# EAGLE design PowerDeliveryCurrent (EAGLE 7.6.0)
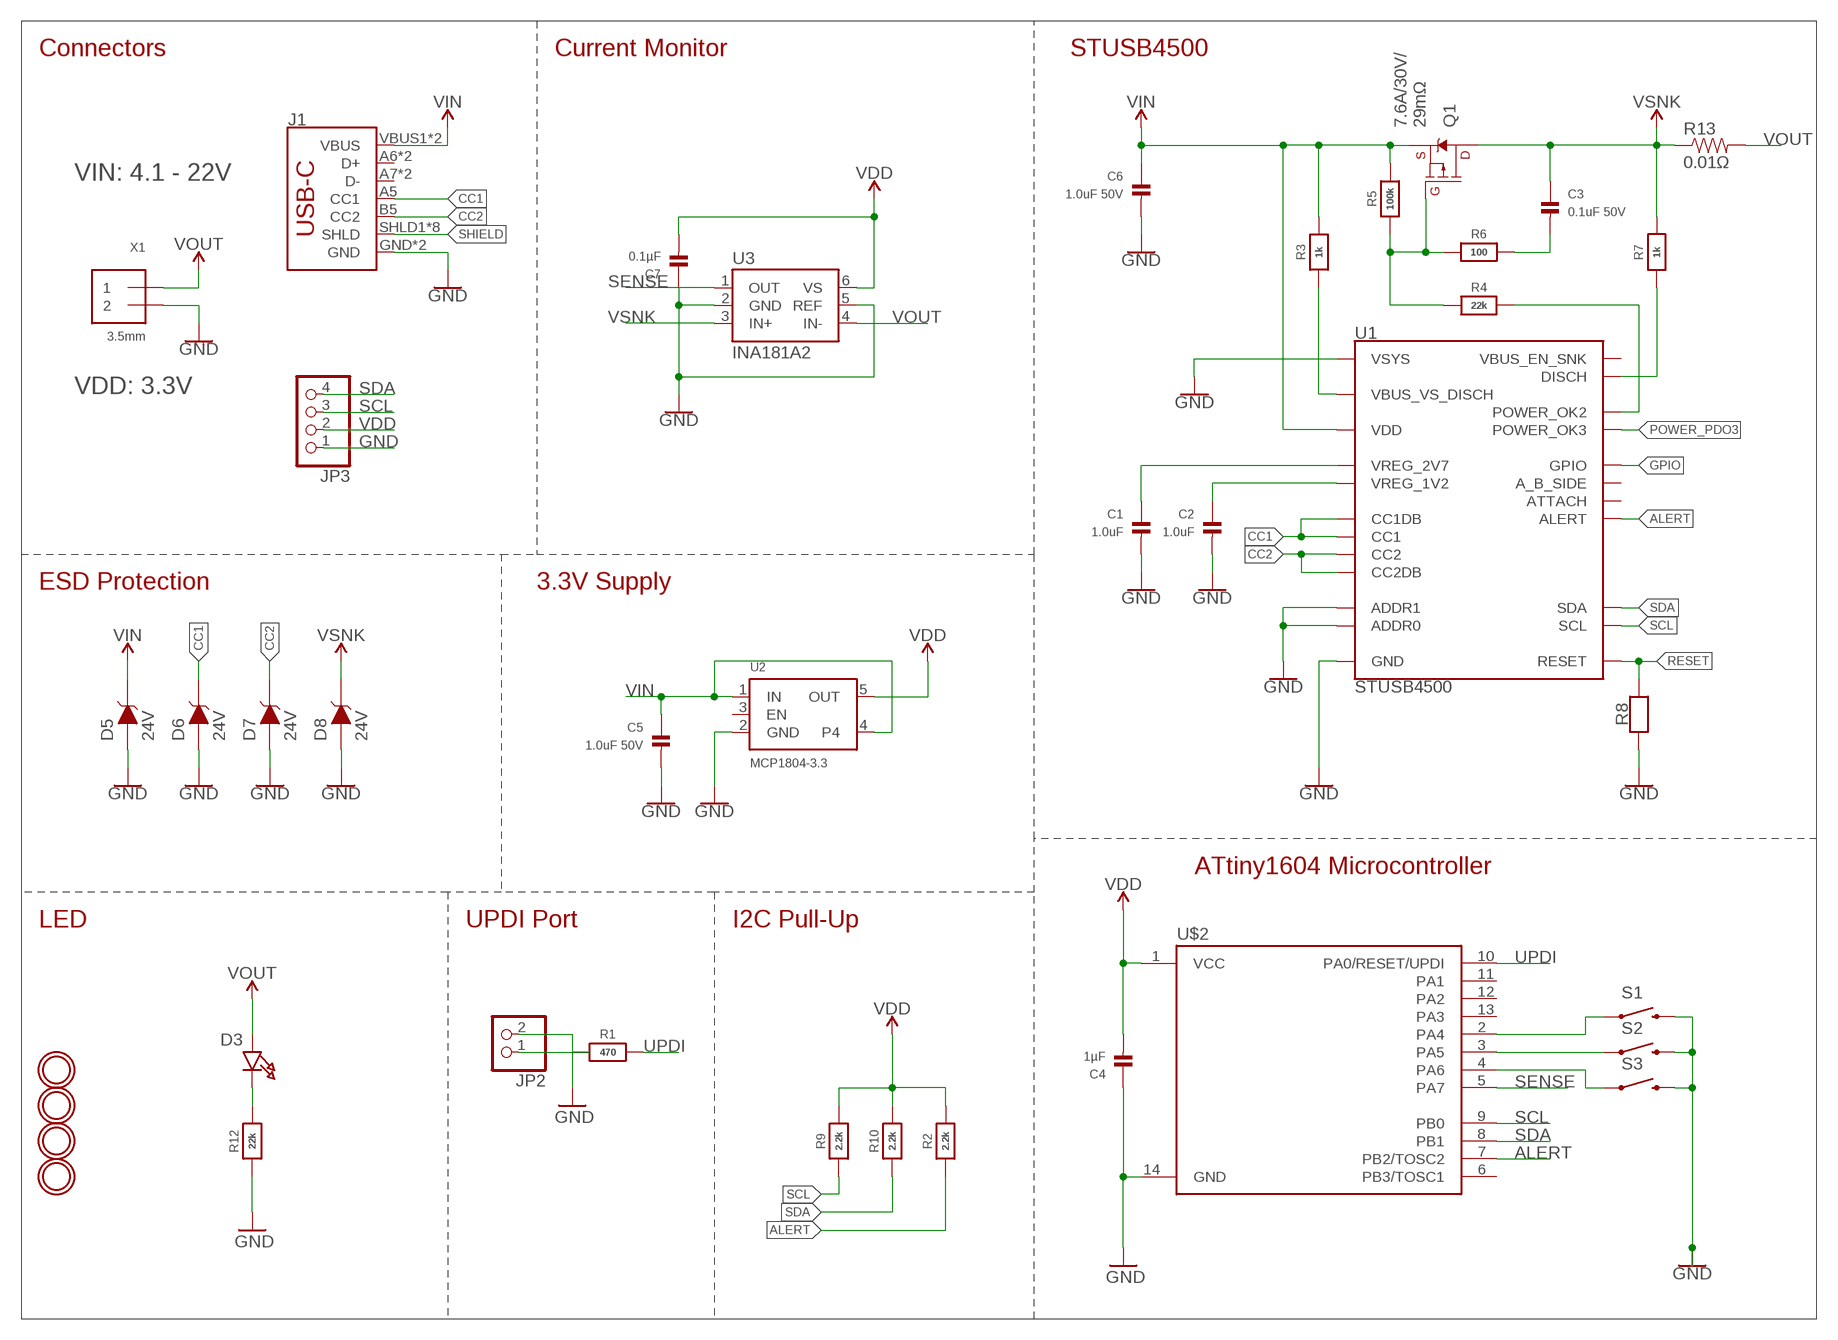
[diagram p0: schematic, sheet 1]

## Parts
C1  1.0uF  CAP_CERAMIC_0805MP  [_0805MP]
C2  1.0uF  CAP_CERAMIC_0805MP  [_0805MP]
C3  0.1uF 50V  CAP_CERAMIC_0805MP  [_0805MP]
C4  1µF  CAP_CERAMIC_0805MP  [_0805MP]
C5  1.0uF 50V  CAP_CERAMIC_0805MP  [_0805MP]
C6  1.0uF 50V  CAP_CERAMIC_0805MP  [_0805MP]
C7  0.1µF  CAP_CERAMIC_0805MP  [_0805MP]
D3  GREEN  LED0805_NOOUTLINE  [CHIPLED_0805_NOOUTLINE]
D5  24V  DIODE_TVS  [0603]
D6  24V  DIODE_TVS  [0603]
D7  24V  DIODE_TVS  [0603]
D8  24V  DIODE_TVS  [0603]
J1  USB_C2-LAYER  [USB-C-16P]
JP2  HEADER-1X2ROUND  [1X02_ROUND]
JP3  HEADER-1X4ROUND  [1X04_ROUND]
Q1  9A/30V/15mΩ  MOSFET_PCH-STL9P3LLH6  [8-POWERVDFN-3X3]
R1  470  RESISTOR_0805MP  [_0805MP]
R2  2.2k  RESISTOR_0805MP  [_0805MP]
R3  1k  RESISTOR_0805MP  [_0805MP]
R4  22k  RESISTOR_0805MP  [_0805MP]
R5  100k  RESISTOR_0805MP  [_0805MP]
R6  100  RESISTOR_0805MP  [_0805MP]
R7  1k  RESISTOR_0805MP  [_0805MP]
R8  100k  RESISTOR_0805MP  [_0805MP]
R9  2.2k  RESISTOR_0805MP  [_0805MP]
R10  2.2k  RESISTOR_0805MP  [_0805MP]
R12  22k  RESISTOR_0805MP  [_0805MP]
R13  0.01Ω  RESISTOR1206  [1206]
S1  SWITCH-MOMENTARY-2SMD-4.6X2.8MM  [TACTILE_SWITCH_SMD_4.6X2.8MM]
S2  SWITCH-MOMENTARY-2SMD-4.6X2.8MM  [TACTILE_SWITCH_SMD_4.6X2.8MM]
S3  SWITCH-MOMENTARY-2SMD-4.6X2.8MM  [TACTILE_SWITCH_SMD_4.6X2.8MM]
U1  STUSB4500  [QFN-24]
U2  MCP1804-3.3  VREG_SOT23-5  [SOT23-5]
U3  INA181A2  MCP4725SOT-23  [SOT23-6]
U$1  MOUNTINGHOLE2.5  [MOUNTINGHOLE_2.5_PLATED]
U$2  ATTINY414  [SO14]
U$3  MOUNTINGHOLE2.5  [MOUNTINGHOLE_2.5_PLATED]
U$4  MOUNTINGHOLE2.5  [MOUNTINGHOLE_2.5_PLATED]
U$6  MOUNTINGHOLE2.5  [MOUNTINGHOLE_2.5_PLATED]
X1  3.5mm  TERMBLOCK_1X2  [TERMBLOCK_1X2-3.5MM]

## Nets
1.2V: C2.1 U1.P$21(VREG_1V2)
2.7V: C1.1 U1.P$23(VREG_2V7)
ALERT: R2.1 U1.P$19(ALERT) U$2.7(PB2/TOSC2)
CC1: D6.2(C) J1.A5(CC1) U1.P$1(CC1DB) U1.P$2(CC1)
CC2: D7.2(C) J1.B5(CC2) U1.P$4(CC2) U1.P$5(CC2DB)
DISCH: R7.2 U1.P$9(DISCH)
EN_SNK: R4.1 U1.P$20(POWER_OK2)
GND: C1.2 C2.2 C4.1 C5.2 C6.2 C7.1 D5.1(A) D6.1(A) D7.1(A) D8.1(A) J1.GND J1.GND2(GND) JP2.2 JP3.1 R8.1 R12.1 S1.3 S1.4 S2.3 S2.4 S3.3 S3.4 U1.P$10(GND) U1.P$12(ADDR0) U1.P$13(ADDR1) U1.P$22(VSYS) U1.P$25(GND) U2.2(GND) U3.2(GND) U3.5(REF) U$2.14(GND) X1.2
GPIO: U1.P$15(GPIO)
N$1: S3.1 S3.2 U$2.4(PA6)
N$2: D3.C R12.2
N$3: JP2.1 R1.1
N$4: S2.1 S2.2 U$2.3(PA5)
N$5: S1.1 S1.2 U$2.2(PA4)
N$8: Q1.4(G) R4.2 R5.1 R6.1
N$10: C3.2 R6.2
POWER_PDO3: U1.P$14(POWER_OK3)
RESET: R8.2 U1.P$6(RESET)
SCL: JP3.3 R9.1 U1.P$7(SCL) U$2.9(PB0)
SDA: JP3.4 R10.1 U1.P$8(SDA) U$2.8(PB1)
SENSE: U3.1(OUT) U$2.5(PA7)
SHIELD: J1.SHLD1(SHLD) J1.SHLD2(SHLD) J1.SHLD3(SHLD) J1.SHLD4(SHLD) J1.SHLD5(SHLD) J1.SHLD6(SHLD) J1.SHLD7(SHLD) J1.SHLD8(SHLD)
UPDI: R1.2 U$2.10(PA0/RESET/UPDI)
VBUS_VS_DISCH: R3.1 U1.P$18(VBUS_VS_DISCH)
VDD: C4.2 C7.2 JP3.2 R2.2 R9.2 R10.2 U2.5(OUT) U3.6(VS) U$2.1(VCC)
VIN: C5.1 C6.1 D5.2(C) J1.VBUS1(VBUS) J1.VBUS2(VBUS) Q1.1(S) Q1.2(S) Q1.3(S) R3.2 R5.2 U1.P$24(VDD) U2.1(IN) U2.4
VOUT: D3.A R13.2 U3.4(IN-) X1.1
VSNK: C3.1 D8.2(C) Q1.5@1(D) Q1.5@2(D) Q1.5@3(D) R7.1 R13.1 U3.3(IN+)
Unconnected: J1.A6(D+) J1.A7(D-) J1.B6(D+) J1.B7(D-) U1.P$11(ATTACH) U1.P$16(VBUS_EN_SNK) U1.P$17(A_B_SIDE) U2.3(EN) U$2.6(PB3/TOSC1) U$2.11(PA1) U$2.12(PA2) U$2.13(PA3)

## Notes on the sheet
- Connectors | Current Monitor | STUSB4500
- 7.6A/30V/
  29mΩ
- VIN: 4.1 - 22V
- VDD: 3.3V
- ESD Protection | 3.3V Supply
- ATtiny1604 Microcontroller
- LED | UPDI Port | I2C Pull-Up

## Library data of the parts
C1-C7 = microbuilder:CAP_CERAMIC: Ceramic Capacitors 0402 - 0402 Surface Mount Capacitors 16pF 50V 5% [Digikey: 445-4899-2-ND] 18pF 50V 5% [Digikey: 490-1281-2-ND] 22pF 50V 5% [Digikey: 490-1283-2-ND] 68pF 50V 5% [Digikey: 490-1289-2-ND] 0.1uF 10V 10% [Digikey: 490-1318-2-ND] 1.0uF 6.3V 10% [Digikey: 490-1320-2-ND] 0603 - 0603 Surface Mount Capacitors 16 pF 50V 5% [Digikey: 445-5051-2-ND] 22 pF 50V [Digikey: PCC220ACVTR-ND] 33 pF 50V 5% [Digikey: 490-1415-1-ND] 56pF 50V 5% [Digikey: 490-1421-1-ND] 220pF 50V 5% [Digikey: 445-1285-1-ND] 680 pF 50V 2200 pF 50V 5% C0G [Digikey: 445-1297-1-ND] 5600 pF 100V 5% X7R [Digikey: 478-3711-1-ND] 0.1 µF 25V 10% [Digikey: PCC2277TR-ND] 0.22 µF 16V 10% X7R [Digikey: 445-1318-1-ND] 1.0 µF 25V 10% [Digikey: 445-5146-2-ND] 0603 - RF Specific 3pF 250V +/-0.1pF RF [Digikey: 712-1347-1-ND] 18 pF 250V 5% [Digikey: 478-3505-1-ND or 712-1322-1-ND] 56 pF 250V 5% C0G RF [Digikey: 490-4867-1-ND] 68 pF 250V RF [Digikey: 490-4868-1-ND] 0805 - 0805 Surface Mount Capacitors 220 pF 250V 2% RF Ceramic Capacitor [Digikey: 712-1398-1-ND] 1000 pF 50V 2% NP0 Ceramic Capacitor [Digikey: 478-3760-1-ND] 0.1 µF 25V 10% Ceramic Capacitor [Digikey: PCC1828TR-ND] 1.0 µF 16V 10% Ceramic Capacitor[Digikey: 490-1691-2-ND] 10.0 µF 10V 10% Ceramic Capacitor[Digikey: 709-1228-1-ND] 10.0 uF 16V 10% Ceramic Capacitor [Digikey: 478-5165-2-ND] 47 uF 6.3V 20% Ceramic Capacitor [Digikey: 587-1779-1-ND or 399-5506-1-ND] 1206 - 1206 Surface Mount Capacitors 47uF 10V 20% Ceramic Capacitor [Digikey: 490-5528-1-ND or 399-5508-1-ND or 445-6010-1-ND] 100uF 6.3V -20%, +80% Y5V Ceramic Capacitor (Digikey: 490-4512-1-ND, Mouser: 81-GRM31CF50J107ZE1L)
D3 = microbuilder:LED: LED 0603 - 0603 Surface Mount Package 2mA: Green LED - Low Power (3.9mcd, 2ma, 1.7Vf) - Digikey: 475-2709-2-ND Orange LED - Low Power (9.8mcd, 2ma, 1.8Vf) - Digikey: 475-1194-2-ND Red LED - Low Power (5mcd, 2ma, 1.8Vf) - Digikey: 475-1195-2-ND Yellow LED - Low Power (7mcd, 2ma, 1.8Vf) - Digikey: 475-1196-2-ND 5mA: Blue LED - Low Power (17mcd, 5ma, 2.9Vf) - Digikey: LNJ937W8CRACT-ND 0805 - 0805 Surface Mount Package 2mA: Red LED (8.8mcd, 2mA, 1.8Vf, Clear) - Low Power [Digikey: 475-2510-1-ND] Green LED (5mcd, 2mA, 1.8Vf, Clear) - Low Power [Digikey: 475-2730-1-ND] Yellow LED (11.3mcd, 2mA, 1.8Vf, Clear) - Low Power [Digikey: 475-2555-1-ND] 20mA: Red LED (104mcd, 20mA, Diffused) - LS R976 [Digikey: 475-1278-6-ND] Red LED (12mcd, 20mA, 2.0Vf, Clear) - APT2012EC [Digikey: 754-1128-1-ND] Green LED (15mcd, 20mA, 2.2Vf, Clear) - APT2012GC [Digikey: 754-1131-1-ND] Orange LED (160mcd, 20mA, 2.1Vf, Clear) - APT2012SECK [Digikey: 754-1130-1-ND] 1206 - 1206 Surface Mount Package Green LED (26mcd, 20mA, Diffused) - LG N971 [Digikey: 475-1407-6-ND] Red LED (15mcd, 20mA, Diffused) - LH N974 [Digikey: 475-1416-6-ND]
D5-D8 = technoblogy:DIODE_TVS; PROD_ID: DIO-14502
J1 = SparkFun-Connectors:USB_C: USB Type C 16Pin Connector Super Speed pins not available on the 16-pin purely SMD connector so this part is best for USB 2.0 implementations. D1 and D2 are tied together enabling D+/- no matter which way the cable is plugged into the connector. The two channel configuration pins (CC1/2) are exposed. These are normally connected to ground via 5.1k resistors but can be reconfigured for high current/high power applications.; PROD_ID: CONN-14122
JP2 = microbuilder:HEADER-1X2: PIN HEADER
JP3 = microbuilder:HEADER-1X4: PIN HEADER
Q1 = SparkFun-DiscreteSemi:MOSFET_PCH: P-channel MOSFETs Voltage controlled devices that allow control of high current outputs. SparkFun Products: SparkFun ESP32 Thing <https://www.sparkfun.com/products/13907> SparkFun ESP8266 Thing <https://www.sparkfun.com/products/13231> SparkFun Pi Servo HAT V2 <https://www.sparkfun.com/products/15316> DMG2305UX-7 (20V/4.2A/SOT23-3); PROD_ID: TRANS-14715
R1-R10 R12 = microbuilder:RESISTOR: Resistors For new designs, use the packages preceded by an '_' character since they are more reliable: The following footprints should be used on most boards: _0402 - Standard footprint for regular board layouts _0603 - Standard footprint for regular board layouts _0805 - Standard footprint for regular board layouts _1206 - Standard footprint for regular board layouts For extremely tight-pitch boards where space is at a premium, the following 'micro-pitch' footprints can be used (smaller pads, no silkscreen outline, etc.): _0402MP - Micro-pitch footprint for very dense/compact boards _0603MP - Micro-pitch footprint for very dense/compact boards _0805MP - Micro-pitch footprint for very dense/compact boards _1206MP - Micro-pitch footprint for very dense/compact boards
R13 = SparkFun-Resistors:RESISTOR: Resistor Basic schematic elements and footprints for 0603, 1206, and PTH resistors.
S1-S3 = SparkFun-Electromechanical:SWITCH-MOMENTARY-2: Various NO switches- pushbuttons, reed, etc; PROD_ID: SWCH-13065
U1 = SparkFun-IC-Power:STUSB4500; PROD_ID: IC-14684
U2 = microbuilder:VREG_SOT23-5: SOT23-5 Fixed Voltage Regulators Part Current Out V Out V In V Dropout θJA (°C/W) TJ (°C) Digikey Part No. ADP121 150mA 3.3V 3.4-5.5V 0.09V @ 150mA -- -- ADP121-AUJZ33R7CT-ND ADP121 150mA 3.0V 3.1-5.5V 0.09V @ 150mA -- -- ADP121-AUJZ30R7CT-ND ADP122 300mA 3.3V 3.4-5.5V 0.085V @ 300mA -- -- ADP122AUJZ-3.3-R7CT-ND ADP1712 300mA 3.3V 3.5-5.5V 0.17V @ 300mA -- -- ADP1712AUJZ-3.3-R7TR-ND AP7311 (Low Cost) 150mA 3.3V 3.5-6V 0.15V @ 150mA -- -- AP7311-33WG-7DICT-ND LD39015M18R 150mA 1.8V 1.9V-5.5V 0.08V @ 100mA -- -- 497-6977-1-ND LP2985A-33DBVR 150mA 3.3V 3.3-16V 0.28V @ 150mA 206 150 296-18479-1-ND MCP1824T-3302E/OT 300mA 3.3V 3.5V-6V 0.2V @ 300mA -- -- MCP1824T-3302E/OTCT-ND MIC5205-2.5YM5 TR 150mA 2.5V 2.7-16V 0.165V @ 150mA -- -- 576-1257-2-ND MIC5205-3.0YM5 TR 150mA 3.0V 3.2V-16V 0.165V @ 150mA -- -- 576-1258-2-ND MIC5205-3.3YM5 TR 150mA 3.3V 3.5V-16V 0.165V @ 150mA -- -- 576-1259-2-ND TPS780330220 150mA 3.3V+2.2V 3.6-5.5V 250mV Max -- -- 296-23332-1-ND TDA3663/N1,135 100mA 3.3V 3.5-45V 0.18V @ 50mA -- -- 568-5343-1-ND Max operating temp can be calculated using θJA, TJ (max junction temperature), and power in watts. Set the "Maximum Ambient Temperature" until it reaches TJ ("Max Junction Temperature"), which is the absolute limit for safe use of the regulator: Heat Sink Temperature Calculator <http://www.daycounter.com/Calculators/Heat-Sink-Temperature-Calculator.phtml> For example, With 12V source into a 3.3V LP2985 and a 30mA load, we are dissipating (12V-3.3V) * 0.03A = 0.261W. With a θJA of 206 °C/W, a TJ of 150°C, and 261mW we can safely use the chip without a heat sink up to 75°C (=147.1°C Junction Temperature).
U3 = technoblogy:MCP4725: Current Sensor; PROD_ID: IC-08886; VALUE: MCP4725
U$1 U$3 U$4 U$6 = microbuilder:MOUNTINGHOLE: Mounting Hole For #2 screws (0.086"/2.18mm width, 0.094"/2.4mm hole) use 2.5mm; BOM: EXCLUDE
U$2 = technoblogy:ATTINY414: Atmel 14-pin 2/4/8kB flash uC; PROD_ID: IC-11285
X1 = microbuilder:TERMBLOCK_1X2: 3.5mm Terminal block http://www.ladyada.net/library/pcb/eaglelibrary.html

## Net classes
0 default: width 0.152 mm, drill 0.305 mm, clearance 0.152 mm

## Board
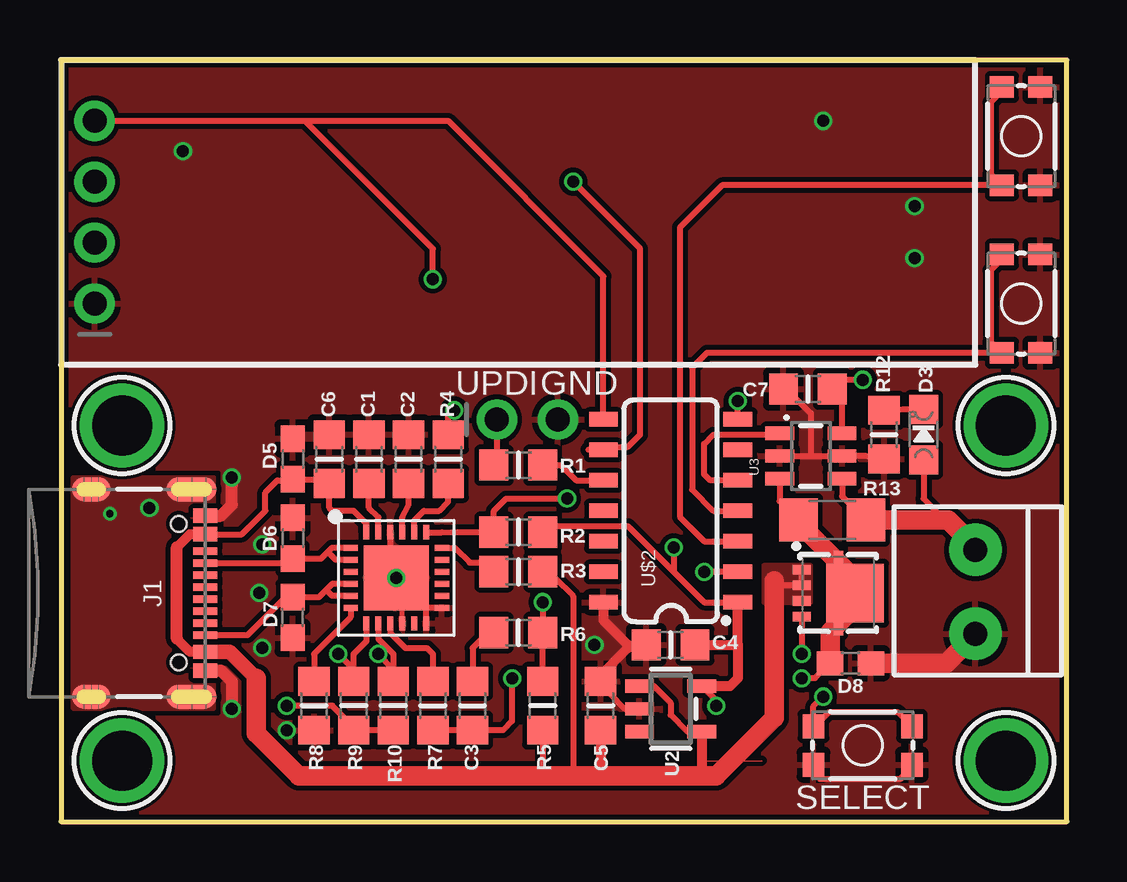
[diagram p1: board, top side]
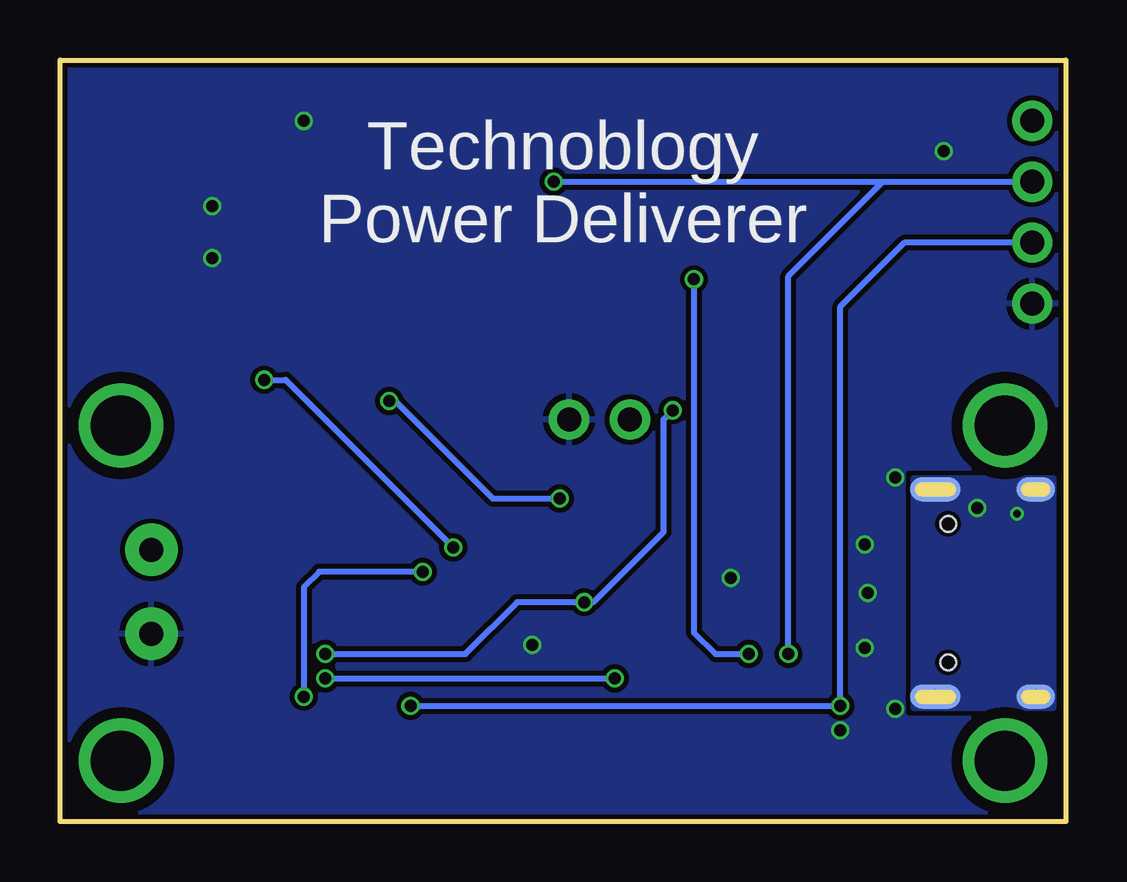
[diagram p2: board, bottom side, seen from below]

Size 41.91 x 31.75 mm. Coordinates in mm from the lower left corner, seen from the top.
Outline: 41.91,0 41.91,31.75 0,31.75 0,0 41.91,0
Copper layers (1*16): Top 0.035mm / dielectric 1.5mm / Bottom 0.035mm
Design rules "SparkFun-2-layer-FAB-LIMIT": minimum track width 4mil, minimum drill 6mil, track to track 4mil, track to pad 4mil, pad to pad 4mil, via to via 4mil, smd to smd 4mil, copper to edge 4mil, drill to drill 4mil, minimum pad ring 5mil, minimum via ring 5mil, stop-mask expansion 4mil, vias tented up to drill 25mil, thermal gap 10mil
tRestrict: 4 lines

### Footprints (pad centres in the part's own frame; a part is rotated, then mirrored left to right if it is on the bottom)
_0805MP = smd 1.2 x 1.3: 1 -1.016,0; 2 1.016,0
CHIPLED_0805_NOOUTLINE = smd 1.2 x 1.2: A 0,-1.05; C 0,1.05
0603 = smd 1.1 x 1: 1 -0.85,0; 2 0.85,0
USB-C-16P = smd 0.3 x 1: A5 -1.25,-0.34; A6 -0.25,-0.34; A7 0.25,-0.34; A8 1.25,-0.34; B5 1.75,-0.34; B6 0.75,-0.34; B7 -0.75,-0.34; B8 -1.75,-0.34 | smd 0.6 x 1: GND -3.225,-0.34; GND2 3.225,-0.34; VBUS1 -2.45,-0.34; VBUS2 2.45,-0.34 | smd 1 x 2.1: SHLD1 -4.32,-0.915; SHLD2 4.32,-0.915 | smd 1 x 2.1 bottom: SHLD3 -4.32,-0.915; SHLD4 4.32,-0.915 | smd 1 x 1.6: SHLD5 -4.32,-5.095; SHLD8 4.32,-5.095 | smd 1 x 1.6 bottom: SHLD6 -4.32,-5.095; SHLD7 4.32,-5.095 | hole 0.65: -2.89,-1.445; 2.89,-1.445
1X02_ROUND = drill 1 pad 1.676: 1 -1.27,0; 2 1.27,0
1X04_ROUND = drill 1 pad 1.676: 1 -3.81,0; 2 -1.27,0; 3 1.27,0; 4 3.81,0
8-POWERVDFN-3X3 = smd 0.4 x 0.75: 1 -0.975,-1.525; 2 -0.325,-1.525; 3 0.325,-1.525; 4 0.975,-1.525 | smd 2.45 x 2.4: 5@1 0,0.7 | smd 0.53 x 0.4: 5@2 -1.49,0; 5@3 1.49,0
1206 = smd 1.6 x 1.8: 1 -1.4,0; 2 1.4,0
TACTILE_SWITCH_SMD_4.6X2.8MM = smd 0.9 x 1: 1 -2.05,-0.8; 2 2.05,-0.8; 3 2.05,0.8; 4 -2.05,0.8
QFN-24 = smd 0.6 x 0.25: P$1 -1.9,1.25; P$2 -1.9,0.75; P$3 -1.9,0.25; P$4 -1.9,-0.25; P$5 -1.9,-0.75; P$6 -1.9,-1.25; P$13 1.9,-1.25; P$14 1.9,-0.75; P$15 1.9,-0.25; P$16 1.9,0.25; P$17 1.9,0.75; P$18 1.9,1.25 | smd 0.25 x 0.6: P$7 -1.25,-1.9; P$8 -0.75,-1.9; P$9 -0.25,-1.9; P$10 0.25,-1.9; P$11 0.75,-1.9; P$12 1.25,-1.9; P$19 1.25,1.9; P$20 0.75,1.9; P$21 0.25,1.9; P$22 -0.25,1.9; P$23 -0.75,1.9; P$24 -1.25,1.9 | smd 2.7 x 2.7: P$25 0,0
SOT23-5 = smd 0.55 x 1.2: 1 -0.95,-1.3; 2 0,-1.3; 3 0.95,-1.3; 4 0.95,1.3; 5 -0.95,1.3
SOT23-6 = smd 0.55 x 1.2: 1 0.95,1.3; 2 0,1.3; 3 -0.95,1.3; 4 -0.95,-1.3; 5 0,-1.3; 6 0.95,-1.3
MOUNTINGHOLE_2.5_PLATED = drill 2.5 pad 3.2: P$1 0,0
SO14 = smd 0.6 x 1.2: 1 -3.81,-2.8; 2 -2.54,-2.8; 3 -1.27,-2.8; 4 0,-2.8; 5 1.27,-2.8; 6 2.54,-2.8; 7 3.81,-2.8; 8 3.81,2.8; 9 2.54,2.8; 10 1.27,2.8; 11 0,2.8; 12 -1.27,2.8; 13 -2.54,2.8; 14 -3.81,2.8
TERMBLOCK_1X2-3.5MM = drill 1 pad 2.184: 1 1.8,0; 2 -1.7,0

### Placement (x,y rotation side)
C1  12.83,15.11 90 top
C2  14.48,15.11 90 top
C3  17.14,4.83 90 top
C4  25.4,7.37 0 top
C5  22.48,4.83 90 top
C6  11.18,15.11 90 top
C7  31.11,18.03 0 top
D3  35.94,16.13 0 top
D5  9.65,15.11 270 top
D6  9.65,11.81 270 top
D7  9.65,8.51 90 top
D8  32.89,6.6 180 top
J1  6.35,9.53 270 top
JP2  19.43,16.76 0 top
JP3  1.4,25.4 90 top
Q1  32.38,9.53 270 top
R1  19.05,14.86 0 top
R2  19.05,12.06 0 top
R3  19.05,10.41 0 top
R4  16.13,15.11 90 top
R5  20.07,4.83 270 top
R6  19.05,7.87 180 top
R7  15.49,4.83 90 top
R8  10.54,4.83 90 top
R9  12.19,4.83 270 top
R10  13.84,4.83 270 top
R12  34.29,16.13 90 top
R13  32.13,12.57 0 top
S1  33.4,3.18 180 top
S2  40.01,28.57 270 top
S3  40.01,21.59 270 top
U1  13.97,10.16 0 top
U2  25.4,4.7 270 top
U3  31.24,15.24 90 top
U$1  39.37,2.54 0 top
U$2  25.4,12.95 90 top
U$3  39.37,16.51 0 top
U$4  2.54,2.54 0 top
U$6  2.54,16.51 0 top
X1  38.1,9.53 90 top

### Tracks (layer width: path | path; a pad name or v marks a point on that pad's centre or on a via)
1.2V
  Top 0.254: U1.P$21 14.22,12.7 14.48,13.21 C2.1
2.7V
  Top 0.254: U1.P$23 13.22,12.69 12.83,13.08 C1.1
ALERT  (via drill 0.5)
  Top 0.254: U1.P$19 15.87,12.06 16.51,12.06 R2.1 18.03,12.95 18.54,13.46 v21.08,13.46 | U$2.7 v28.2,17.52 v28.19,17.53
  Bottom 0.254: v28.19,17.53 27.94,17.53 23.88,13.46 v21.08,13.46
CC1
  Top 0.254: J1.A5 9.47,10.78 D6.2 10.83,10.96 11.11,11.24 | U1.P$1 11.28,11.41 11.11,11.24 | U1.P$2 11.44,10.91 11.11,11.24
CC2
  Top 0.254: J1.B5 7.78,7.78 9.27,9.27 9.56,9.27 D7.2 10.76,9.36 11.05,9.65 | U1.P$5 11.29,9.41 11.05,9.65 | U1.P$4 11.31,9.91 11.05,9.65
DISCH
  Top 0.254: U1.P$9 13.72,7.87 14.35,7.24 15.24,7.24 15.49,6.99 R7.2
EN_SNK
  Top 0.254: U1.P$20 14.72,12.56 15.11,12.95 15.75,12.95 16.13,13.33 R4.1
GND  (via drill 0.5)
  Top 0.178: C7.1 30.23,18.03
  Top 0.203: U1.P$10 14.22,9.91 U1.P$25
  Top 0.254: 23.62,7.37 C4.1 23.75,7.37 23.62,7.24 22.86,6.48 | 22.86,5.33 23.5,4.7 U2.2 | 13.72,10.41 U1.P$25 | U1.P$22 13.72,10.41 U1.P$25 | U1.P$12 15.22,8.91 | U1.P$13 15.22,8.91 | 15.22,8.91 U1.P$25 | U3.2 31.24,15.24 | 31.24,15.24 U3.5 33.53,15.24 34.42,14.99 R12.1 | 30.23,18.03 31.24,17.02 31.24,15.24 | S1.3 31.41,1.99 31.62,1.78 34.98,1.78 S1.4
  Top 0.406: U$2.14 22.6,8.39 23.62,7.37 | C5.2 22.48,6.1 23.62,7.24 | C4.1 24.13,7.62
  Top 0.508: 7.11,14.02 v7.11,14.35 7.11,13.21 6.65,12.75 J1.GND | J1.GND2 6.65,6.3 7.11,5.84 v7.11,4.7
  Top 0.813: D8.1 36.88,6.6 X1.2
  other vias: 13.97,10.16 8.38,11.56 5.08,27.94 8.26,9.53 22.23,7.37 8.38,7.24 9.4,3.81 35.56,23.49 35.56,25.65 31.75,29.21
  pour Top (isolate 0.203, rank 2): 0,31.75 41.91,31.75 41.91,0 0,0
  pour Bottom (isolate 0.203, rank 2): 0,31.75 41.91,31.75 41.91,0 0,0
N$1
  Top 0.254: U$2.4 27.18,12.95 26.29,13.84 26.29,18.92 26.91,19.54 S3.2 38.73,20.01 38.73,22.99 39.2,23.46 S3.1
N$2
  Top 0.254: D3.C 35.09,17.18 R12.2
N$3
  Top 0.254: JP2.1 18.16,14.99 R1.1
N$4
  Top 0.254: U$2.3 26.8,11.68 25.78,12.7 25.78,24.77 27.54,26.52 S2.2 38.73,26.99 38.73,29.97 39.2,30.44 S2.1
N$5  (via drill 0.5)
  Top 0.254: U$2.2 v26.8,10.41 | v31.75,5.21 31.35,4.81 S1.2 31.41,3.97 32,4.57 34.85,4.57 S1.1
  Bottom 0.254: v26.8,10.41 31.11,10.41 31.75,9.78 v31.75,5.21
N$8  (via drill 0.5)
  Top 0.254: R5.1 R6.1 | 20.28,7.75 20.28,7.62 | 20.28,7.62 20.28,7.33 | 16.38,16.38 R4.2 16.13,16.89 v16.38,17.15 | Q1.4 v30.86,6.99 | v20.07,9.14 R6.1 | R6.1 20.07,7.84 20.28,7.62
  Bottom 0.254: v16.38,17.15 16.76,16.76 16.76,12.06 19.68,9.14 v20.07,9.14 22.86,9.14 25.02,6.99 v30.86,6.99
N$10
  Top 0.254: R6.2 17.78,7.87 17.14,7.24 C3.2
RESET
  Top 0.254: U1.P$6 12.07,8.51 10.54,6.99 R8.2
SCL  (via drill 0.5)
  Top 0.254: 21.97,15.49 U$2.9 22.73,15.62 23.62,15.62 24.13,16.13 24.13,23.88 v21.34,26.67 | R9.1 12.19,6.35 | 12.19,6.35 12.19,6.99 12.72,7.51 U1.P$7 | v11.56,6.99 12.19,6.35
  Bottom 0.254: v11.56,6.99 11.56,22.73 7.62,26.67 | v21.34,26.67 7.62,26.67 | 7.62,26.67 JP3.3
SDA  (via drill 0.5)
  Top 0.254: U1.P$8 13.22,7.61 13.84,6.99 13.84,6.35 | 13.84,6.35 R10.1 | JP3.4 10.16,29.21 | 10.16,29.21 16.13,29.21 22.6,22.74 U$2.8 | v13.21,6.99 13.84,6.35 | v15.49,22.61 15.49,23.88 10.16,29.21
  Bottom 0.254: v15.49,22.61 15.49,7.87 14.61,6.99 v13.21,6.99
SENSE
  Top 0.254: U$2.5 27.05,14.22 26.8,14.48 26.8,15.75 27.18,16.13 29.88,16.13 U3.1
SHIELD  (via drill 0.3, 0.5)
  other vias: 3.68,13.08 2.03,12.83
  pour Top (isolate 0.203, no thermals): 0.51,14.35 6.35,14.35 6.35,4.7 0.51,4.7
  pour Bottom (isolate 0.203, no thermals): 6.35,14.35 0.51,14.35 0.51,4.7 6.35,4.7
UPDI
  Top 0.254: R1.2 20.83,14.86 21.46,14.22 U$2.10
VBUS_VS_DISCH
  Top 0.254: U1.P$18 16.4,11.41 17.02,10.79 17.65,10.79 R3.1
VDD  (via drill 0.5)
  Top 0.254: R9.2 R10.2 12.32,3.81 11.3,4.83 v9.4,4.83 | v27.3,4.83 27.27,5.08 U2.5 | R2.2 20.32,12.32 23.62,12.32 25.53,10.41 | 25.53,10.41 26.8,9.14 U$2.1 | U3.6 32.54,17.62 C7.2 32.51,18.41 v33.4,18.41 | v25.53,11.43 25.53,10.41
  Top 0.406: 28.2,7.37 U$2.1 | C4.2 28.2,7.37 | U2.5 27.87,5.65 28.2,5.97 28.2,7.37
  Bottom 0.254: v27.3,4.83 v9.4,4.83 9.4,21.46 6.73,24.13 JP3.2 | v33.4,18.41 32.51,18.41 v25.53,11.43
VIN
  Top 0: 26.54,1.91 27.3,1.91 26.67,2.54 29.21,2.54
  Top 0.254: J1.VBUS1 7.53,11.97 8.51,12.95 8.51,13.72 9.02,14.22 9.61,14.22 D5.2 11.01,14.26 C6.1 11.18,13.08 11.3,12.95 12.19,12.95 12.72,12.43 U1.P$24 | 21.34,1.91 21.34,9.4 20.57,10.16 20.32,10.16 R3.2 | 20.32,1.91 20.07,2.29 R5.2 | U2.1 24.7,5.65 25.4,4.95 25.4,4.45 26.1,3.75 U2.4 | 29.72,9.78 29.79,9.85 Q1.2 Q1.1
  Top 0.406: J1.VBUS1 5.37,11.97 4.83,11.43 | J1.VBUS2 5.37,7.08 4.83,7.62 | C5.1 22.48,1.91 | U2.4 26.7,1.94 27.3,1.91
  Top 0.508: 4.83,7.62 4.83,11.43
  Top 0.61: 8.13,5.97 7.02,7.08 J1.VBUS2
  Top 0.813: 8.13,5.97 8.13,3.68 9.91,1.91 20.32,1.91 21.34,1.91 22.48,1.91 27.3,1.91 29.72,4.32 29.72,9.78 29.72,10.03
  pour Top (no thermals): 31.24,10.67 29.27,10.67 29.27,9.14 31.24,9.14
VOUT
  Top 0.254: U3.4 32.54,13.56 R13.2 | D3.A 35.94,13.46 36.83,12.57
  Top 0.813: X1.1 38.1,11.43 36.96,12.57 36.83,12.57 R13.2
VSNK  (via drill 0.5)
  Top 0.254: R7.1 C3.1 18.41,3.81 18.8,4.19 v18.8,5.97 | U3.3 29.94,13.36 R13.1 | D8.2 31.41,5.97 v30.86,5.97 | Q1.5@2 32.38,10.79 33.02,10.16 | Q1.5@3 32.38,8.26
  Top 0.813: R13.1 30.73,12.45 33.02,10.16 33.09,10.1 Q1.5@1 33.02,9.46 33.02,8.89 32.38,8.26 32.04,7.91 D8.2
  Bottom 0.254: v30.86,5.97 v18.8,5.97

### Text on the board
tPlace: UPDI | GND | SELECT
bPlace: Technoblogy / Power Deliverer